# Altium schematic sheet Blink_Blink_Beep_Boop.SchDoc: Blinks and Boops
size Legal; DocumentNumber: 8; SheetNumber: 8; SheetTotal: 8; Project: Olympus
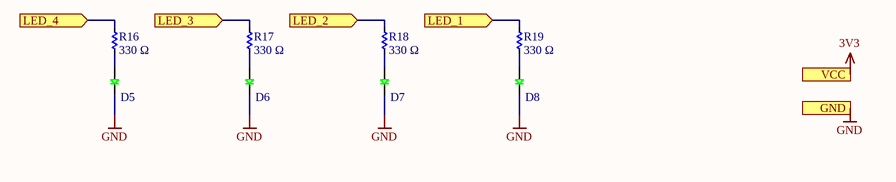
[diagram p0: Blink_Blink_Beep_Boop.SchDoc]

## Parts
D5  LED_C503B-GCS-CB0C0781  [LED_TH_5MM]  (value not drawn)
D6  LED_C503B-GCS-CB0C0781  [LED_TH_5MM]  (value not drawn)
D7  LED_C503B-GCS-CB0C0781  [LED_TH_5MM]  (value not drawn)
D8  LED_C503B-GCS-CB0C0781  [LED_TH_5MM]  (value not drawn)
R16  Resistance: 330 Ω  [R0603]  (hidden comment: 311-330HRCT-ND)
R17  Resistance: 330 Ω  [R0603]  (hidden comment: 311-330HRCT-ND)
R18  Resistance: 330 Ω  [R0603]  (hidden comment: 311-330HRCT-ND)
R19  Resistance: 330 Ω  [R0603]  (hidden comment: 311-330HRCT-ND)

## Ports
GND (in), LED_1 (in), LED_2 (in), LED_3 (in), LED_4 (in), VCC (in)

## Nets
3V3: port VCC
GND: D5.2(K) D6.2(K) D7.2(K) D8.2(K) ; port GND
LED_1: R19.2 ; port LED_1
LED_2: R18.2 ; port LED_2
LED_3: R17.2 ; port LED_3
LED_4: R16.2 ; port LED_4
NetD5_1: D5.1(A) R16.1
NetD6_1: D6.1(A) R17.1
NetD7_1: D7.1(A) R18.1
NetD8_1: D8.1(A) R19.1

## Notes on the sheet
- PROJECT
- SHEET
- Powered By
- Sheet
- of
- REVISION
- ssi.stanford.edu
- ENGINEER
- REVIEWER
- REVIEWED ON

## Library data of the parts
D5-D8 = CMP-033-0070-3: LED GREEN CLEAR 5MM ROUND T/H; Manufacturer: Cree; Lens Colour: Colorless; Luminous Intensity: 24850mcd; Viewing Angle: 30°; Forward Current: 20mA; Forward Voltage: 3.2V; Lens Style: Dome; Dominant Wavelength: 527nm; Power Rating: 120mW; Reverse Voltage (DC): 5V; Number of LEDs: 1; Manufacturer Part Number: C503B-GCS-CB0C0781; Stock 1: 191; Pricing 1: 1=0.25, 10=0.236, 100=0.2184, 1000=0.1954, 50000=0.1814 (USD); Mount: Through Hole; Case/Package: Radial; Colour: Green; Min Operating Temperature: -40°C; Max Operating Temperature: 95°C; Illumination Colour: Green; Packaging: Bulk; Package Quantity: 500; Lens Transparency: Clear; Test Current: 20mA; Wavelength: 527nm; Length: 5.8mm; Height: 12.7mm; Width: 5mm; ComponentLink1URL: http://www.mouser.com/ds/2/90/cree.C503B%20BAS%20BAN%20BCS%20BCN%20GAS%20GAN%20GCS%20GCN%201094[1]-310350.pdf; ComponentLink1Description: http://www.mouser.com/ds/2/90/cree.C503B%20BAS%20BAN%20BCS%20BCN%20GAS%20GAN%20GCS%20GCN%201094[1]-310350.pdf; ComponentLink2URL: http://www.cree.com/led-components/media/documents/C503B-BAS-BAN-BCS-BCN-GAS-GAN-GCS-GCN-1094.pdf; ComponentLink2Description: http://www.cree.com/led-components/media/documents/C503B-BAS-BAN-BCS-BCN-GAS-GAN-GCS-GCN-1094.pdf; Design Item ID: LED_C503B-GCS-CB0C0781; Source: diode.SchLib
R16-R19 = CMP-126-0120-2: RES SMD 330 OHM 1% 1/10W 0603; Manufacturer Part Number: RC0603FR-07330RL; Manufacturer: Yageo; Resistance (Sortable): 330; Power (Watts): 0.1W, 1/10W; Temperature Coefficient: ±100ppm/°C; Datasheets: http://www.yageo.com/documents/recent/PYu-RC_Group_51_RoHS_L_9.pdf; Image: //media.digikey.com/Renders/Yageo%20Renders/0603-(1608-Metric).jpg; Tolerance: ±1%; Operating Temperature: -55°C ~ 155°C